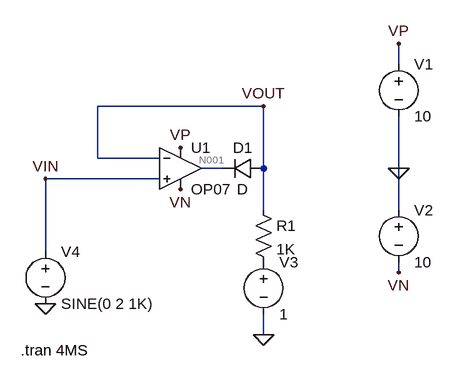
[diagram p0: schematic CLIPPER_POS.asc]
CLIPPER_POS.asc, the LTspice schematic file:
Version 4
SHEET 1 1584 680
WIRE 496 -128 496 -160
WIRE 288 -64 32 -64
WIRE 32 16 32 -64
WIRE 128 16 32 16
WIRE 224 32 192 32
WIRE 288 32 288 -64
WIRE 496 32 496 -48
WIRE 128 48 -48 48
WIRE 288 96 288 32
WIRE 496 96 496 32
WIRE -48 160 -48 48
WIRE 496 192 496 176
WIRE 288 288 288 256
FLAG 496 32 0
FLAG 496 -160 VP
FLAG 160 0 VP
FLAG 160 64 VN
FLAG 496 192 VN
FLAG -48 240 0
FLAG 288 288 0
FLAG -48 48 VIN
FLAG 288 -64 VOUT
SYMBOL OpAmps\\OP07 160 -32 R0
SYMATTR InstName U1
SYMBOL voltage 496 -144 R0
WINDOW 123 0 0 Left 0
WINDOW 39 0 0 Left 0
SYMATTR InstName V1
SYMATTR Value 10
SYMBOL voltage 496 80 R0
WINDOW 123 0 0 Left 0
WINDOW 39 0 0 Left 0
SYMATTR InstName V2
SYMATTR Value 10
SYMBOL voltage 288 160 R0
WINDOW 123 0 0 Left 0
WINDOW 39 0 0 Left 0
SYMATTR InstName V3
SYMATTR Value 1
SYMBOL voltage -48 144 R0
WINDOW 123 0 0 Left 0
WINDOW 39 0 0 Left 0
SYMATTR InstName V4
SYMATTR Value SINE(0 2 1K)
SYMBOL diode 288 16 R90
WINDOW 0 0 32 VBottom 2
WINDOW 3 32 32 VTop 2
SYMATTR InstName D1
SYMBOL res 272 80 R0
SYMATTR InstName R1
SYMATTR Value 1K
TEXT -86 312 Left 2 !.tran 4MS

The netlist it stands for:
* CLIPPER_POS.asc
XU1 VIN VOUT VP VN N001 LT1001  ; OP07, pins In+ In- V+ V- OUT
V1 VP 0 10
V2 0 VN 10
V3 P001 0 1
V4 VIN 0 SINE(0 2 1K)
D1 VOUT N001 D
R1 VOUT P001 1K
.model D D
.lib standard.dio
.tran 4MS
.lib LTC.lib
.backanno
.end

* Results of the author's LTspice run, read from the files saved beside the schematic
* Operating Point, zero values left out:
*   V(vout) = 922.7 nV
*   V(vp) = 10 V
*   V(vn) = -10 V
*   V(n001) = -655.1 mV
*   V(p001) = 1 V
*   I(D1) = 1 mA
*   I(R1) = -1 mA
*   I(V3) = -1 mA
*   I(V2) = -2.778 mA
*   I(V1) = -1.778 mA
*   Ix(u1:3) = 1.778 mA
*   Ix(u1:4) = -2.778 mA
*   Ix(u1:5) = 1 mA
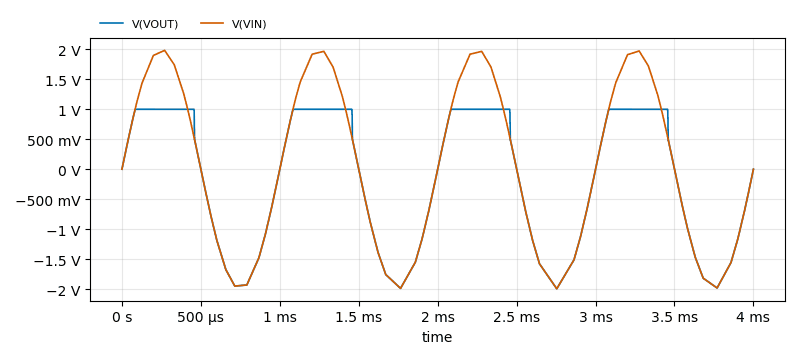
[diagram p1: Transient Analysis of CLIPPER_POS.asc, plotted from the saved traces]
* Transient Analysis, 1 run:
*   V(VOUT): min -1.996 V, max 1 V, average -195.9 mV, rms 1.174 V, last -2.486 mV
*   V(VIN): min -1.997 V, max 1.983 V, average 4.892 mV, rms 1.396 V, last 0 V